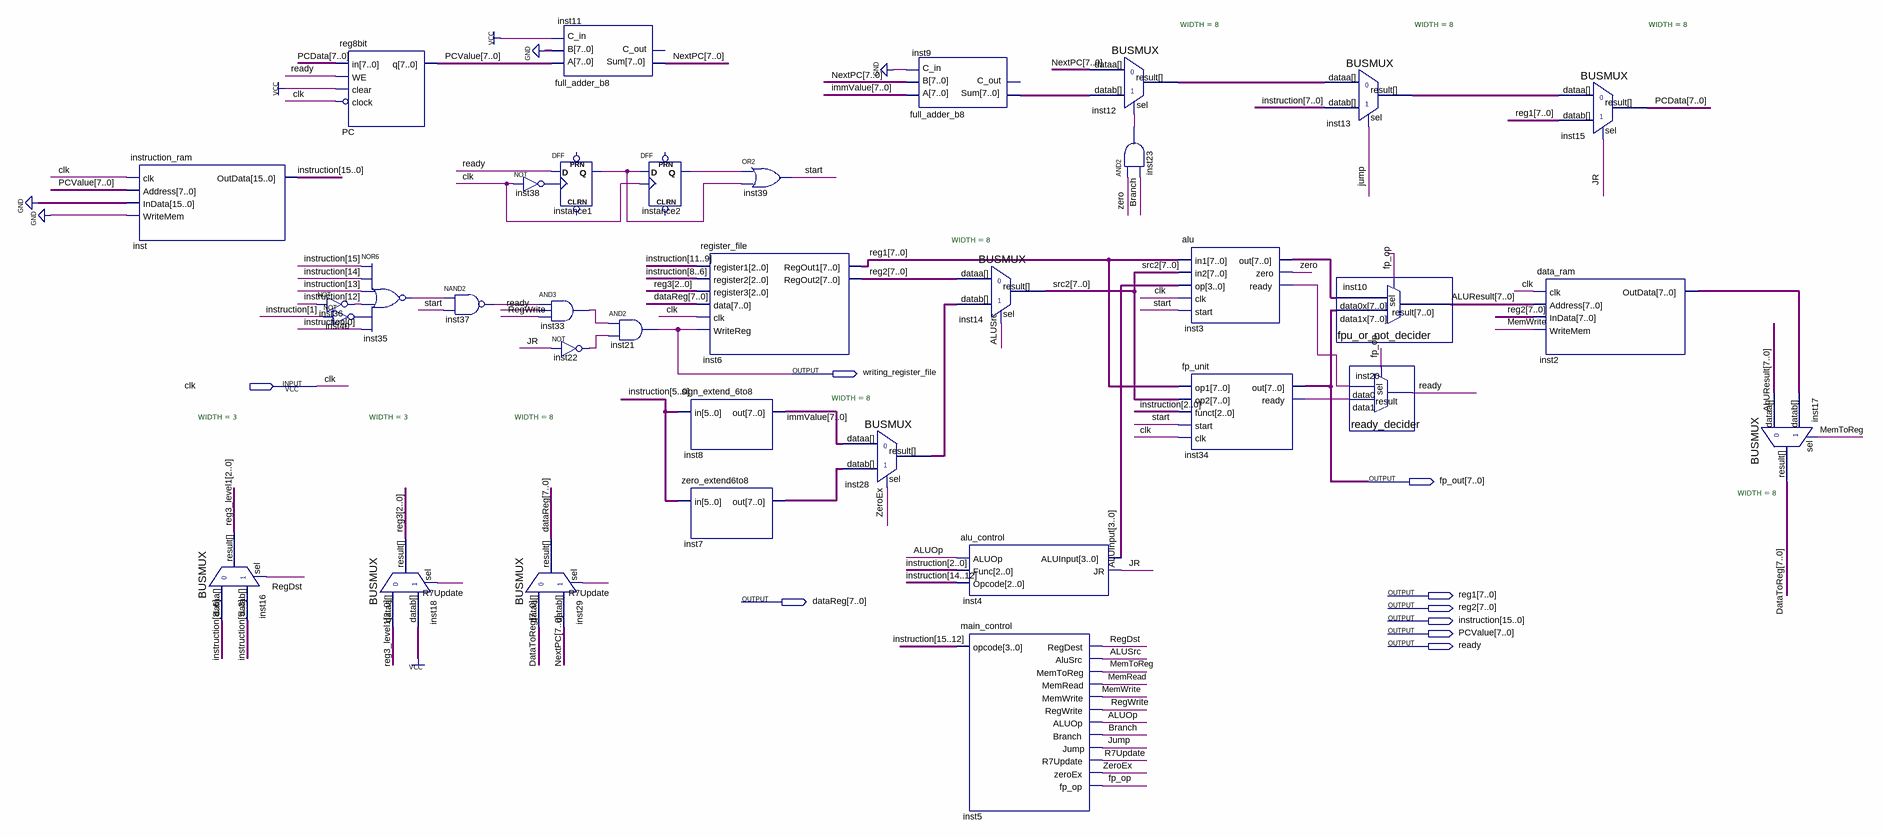
[diagram p0: schematic sheet]
// Quartus schematic data_path.bdf as structural Verilog: 35 symbols, 9 pins
module data_path (
  input  clk,
  output writing_register_file,
  output [7:0] fp_out,
  output [7:0] reg1,
  output [7:0] dataReg,
  output [7:0] reg2,
  output [15:0] instruction,
  output [7:0] PCValue,
  output ready
);

  wire ALUOp, ALUSrc, Branch, fp_op, inst3_ready, inst22_out, inst23_out, inst33_out, inst34_ready,
       inst35_out, inst36_out, inst37_out, inst38_out, inst40_out, instance1_q, instance2_q, JR, jump,
       MemRead, MemToReg, MemWrite, R7Update, RegDst, RegWrite, start, zero, ZeroEx;
  wire [2:0] reg3, reg3_level1;
  wire [3:0] ALUInput;
  wire [7:0] ALUResult, DataToReg, immValue, inst2_outdata, inst3_out, inst7_out, inst9_sum, inst12_result,
       inst13_result, inst28_result, NextPC, PCData, src2;

  instruction_ram inst (.clk(clk), .Address(PCValue), .InData({16{1'b0}}), .WriteMem(1'b0), .OutData(instruction));
  BUSMUX #(.WIDTH(3)) inst16 (.datab(instruction[5:3]), .sel(RegDst), .dataa(instruction[8:6]), .result(reg3_level1));
  not inst36 (inst36_out, instruction[12]);
  not inst40 (inst40_out, instruction[1]);
  reg8bit PC (.in(PCData), .WE(ready), .clear(1'b1), .clock(~clk), .q(PCValue));
  nor inst35 (inst35_out, instruction[15], instruction[14], instruction[13], inst36_out, inst40_out, instruction[0]);
  BUSMUX #(.WIDTH(3)) inst18 (.datab(3'b111), .sel(R7Update), .dataa(reg3_level1), .result(reg3));
  nand inst37 (inst37_out, inst35_out, start);
  not inst38 (inst38_out, clk);
  BUSMUX #(.WIDTH(8)) inst29 (.datab(NextPC), .sel(R7Update), .dataa(DataToReg), .result(dataReg));
  full_adder_b8 inst11 (.A(PCValue), .B({8{1'b0}}), .C_in(1'b1), .Sum(NextPC));  // open: C_out
  DFF instance1 (.CLK(inst38_out), .D(ready), .Q(instance1_q));  // open: CLRN, PRN
  and inst33 (inst33_out, inst37_out, ready, RegWrite);
  not inst22 (inst22_out, JR);
  and inst21 (writing_register_file, inst33_out, inst22_out);
  DFF instance2 (.CLK(clk), .D(instance1_q), .Q(instance2_q));  // open: CLRN, PRN
  sign_extend_6to8 inst8 (.in(instruction[5:0]), .out(immValue));
  zero_extend6to8 inst7 (.in(instruction[5:0]), .out(inst7_out));
  register_file inst6 (
    .register1(instruction[11:9]), .register2(instruction[8:6]), .register3(reg3), .data(dataReg), .clk(clk),
    .WriteReg(writing_register_file), .RegOut1(reg1), .RegOut2(reg2));
  or inst39 (start, instance2_q, instance1_q);
  BUSMUX #(.WIDTH(8)) inst28 (.datab(inst7_out), .sel(ZeroEx), .dataa(immValue), .result(inst28_result));
  full_adder_b8 inst9 (.A(immValue), .B(NextPC), .C_in(1'b0), .Sum(inst9_sum));  // open: C_out
  BUSMUX #(.WIDTH(8)) inst14 (.datab(inst28_result), .sel(ALUSrc), .dataa(reg2), .result(src2));
  alu_control inst4 (.ALUOp(ALUOp), .Func(instruction[2:0]), .Opcode(instruction[14:12]), .ALUInput(ALUInput), .JR(JR));
  main_control inst5 (
    .opcode(instruction[15:12]), .RegDest(RegDst), .AluSrc(ALUSrc), .MemToReg(MemToReg), .MemRead(MemRead),
    .MemWrite(MemWrite), .RegWrite(RegWrite), .ALUOp(ALUOp), .Branch(Branch), .Jump(jump),
    .R7Update(R7Update), .zeroEx(ZeroEx), .fp_op(fp_op));
  BUSMUX #(.WIDTH(8)) inst12 (.datab(inst9_sum), .sel(inst23_out), .dataa(NextPC), .result(inst12_result));
  and inst23 (inst23_out, zero, Branch);
  alu inst3 (
    .in1(reg1), .in2(src2), .op(ALUInput), .clk(clk), .start(start), .out(inst3_out), .zero(zero),
    .ready(inst3_ready));
  fp_unit inst34 (
    .op1(reg1), .op2(src2), .funct(instruction[2:0]), .start(start), .clk(clk), .out(fp_out),
    .ready(inst34_ready));
  BUSMUX #(.WIDTH(8)) inst13 (.datab(instruction[7:0]), .sel(jump), .dataa(inst12_result), .result(inst13_result));
  fpu_or_not_decider inst10 (.data1x(fp_out), .data0x(inst3_out), .sel(fp_op), .result(ALUResult));
  ready_decider inst20 (.data1(inst34_ready), .data0(inst3_ready), .sel(fp_op), .result(ready));
  data_ram inst2 (.clk(clk), .Address(ALUResult), .InData(reg2), .WriteMem(MemWrite), .OutData(inst2_outdata));
  BUSMUX #(.WIDTH(8)) inst15 (.datab(reg1), .sel(JR), .dataa(inst13_result), .result(PCData));
  BUSMUX #(.WIDTH(8)) inst17 (.datab(inst2_outdata), .sel(MemToReg), .dataa(ALUResult), .result(DataToReg));
endmodule
